# Altium schematic sheet Sheet1.SchDoc
size 431 x 279 mm; SheetNumber: 1; SheetTotal: 1; ENG_APP_DATE: --/--/--; DSN_APP_DATE: --/--/--; CHK_APP_DATE: --/--/--
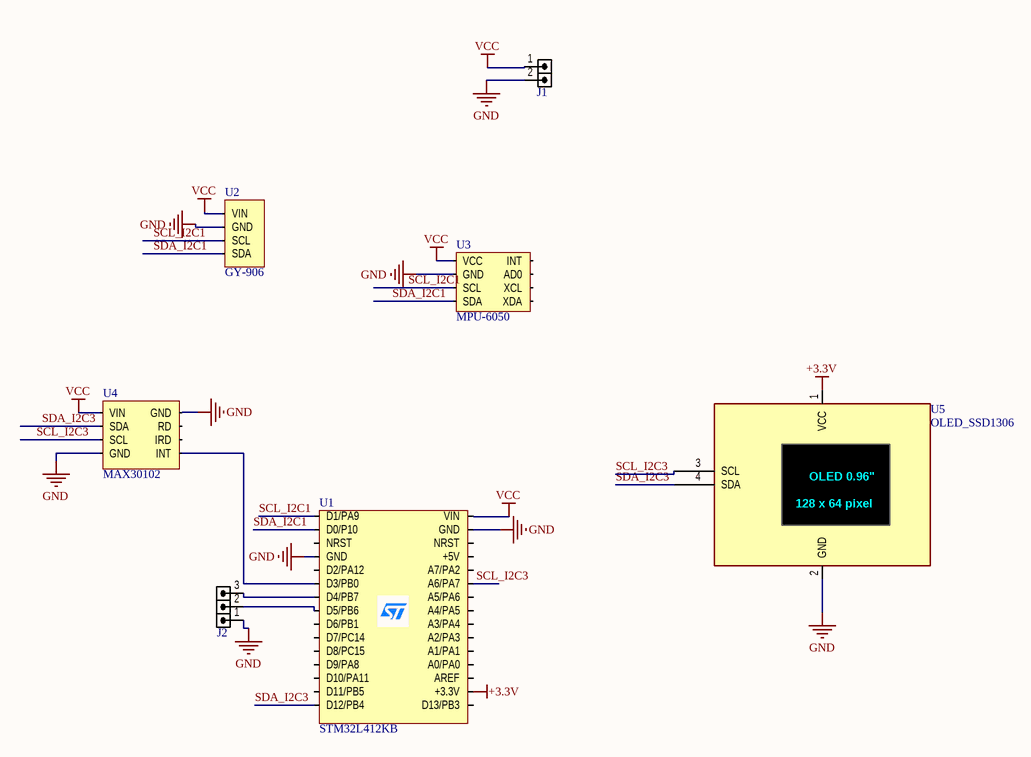
[diagram p0: Sheet1.SchDoc]

## Parts
J1  HDRM2  [HDR_M_1X2]  (value not drawn)
J2  HDRM3  [HDR_M_1X3]  (value not drawn)
U1  STM32L412KB  [NUCLEO32]
U2  GY-906  [GY-906]
U3  MPU-6050  [MPU-6050]
U4  MAX30102  [max30102]
U5  OLED_SSD1306  [OLED_SSD1306_64_I2C]

## Nets
+3.3V: U1.17(+3.3V) U5.1(VCC)
GND: J1.2 J2.1 U1.4(GND) U1.29(GND) U2.2(GND) U3.2(GND) U4.4(GND) U4.8(GND) U5.2(GND)
VCC: J1.1 U1.30(VIN) U2.1(VIN) U3.1(VCC) U4.1(VIN)
SCL_I2C1: U1.1(D1/PA9) U2.3(SCL) U3.3(SCL)
SCL_I2C3: U1.25(A6/PA7) U4.3(SCL) U5.3(SCL)
SDA_I2C1: U1.2(D0/P10) U2.4(SDA) U3.4(SDA)
SDA_I2C3: U1.15(D12/PB4) U4.2(SDA) U5.4(SDA)
NetJ2_2: J2.2 U1.8(D5/PB6)
NetJ2_3: J2.3 U1.7(D4/PB7)
NetU1_6: U1.6(D3/PB0) U4.5(INT)

Not connected (* = marked no-connect by the designer): U1 3(NRST) 5(D2/PA12) 9(D6/PB1) 10(D7/PC14) 11(D8/PC15) 12(D9/PA8) 13(D10/PA11) 14(D11/PB5) 16(D13/PB3) 18(AREF) 19(A0/PA0) 20(A1/PA1) 21(A2/PA3) 22(A3/PA4) 23(A4/PA5) 24(A5/PA6) 26(A7/PA2) 27(+5V) 28(NRST); U3 5(XDA) 6(XCL) 7(AD0) 8(INT); U4 6(IRD) 7(RD)

## Notes on the sheet
- 8
- 7
- 6
- 5
- 4
- 3
- DWG. NO.
- REV.
- SHT.
- 2
- 1
- THIS DOCUMENT AND THE DATA DISCLOSED HEREIN OR HEREWITH IS THE PROPERTY OF ALTIUM LIMITED AND MAY BE FREELY DISTRIBUTED IN WHOLE. NO RIGHTS ARE RESERVED OR EXPRESS OR IMPLIED WARANTEE GIVEN.
- REVISION
- DESCRIPTION
- DATE
- APPROVED
- F
- E
- D
- C
- B
- ENG:
- APPROVALS
- PROJECT
- SUITE 200
- 2175 SALK AVENUE
- CARLSBAD, CA 92008
- A
- DSN:
- CHK:
- REFERENCE DOCUMENTS
- PROJECT REVISION:
- TITLE
- DOCUMENT REVISION:
- DESIGN ITEM:
- USA
- BOM:
- FAB DWG:
- PCB DWG:
- ASSY DWG:
- SCALE:
- SIZE
- CAGE CODE
- FILE NAME
- DWG NO.
- SHEET
- OF
- REV
- (in symbol OLED_SSD1306_64_I2C) OLED 0.96"; 128 x 64 pixel

## Library data of the parts
J1 = Header Male THT 1x2: CONN, HEADER, Male, pitch: 2.54mm, 2POS; VALUE: HDRM2
J2 = Header Male THT 1x3: CONN, HEADER, Male, pitch: 2.54mm, 3POS; VALUE: HDRM3
U5 = OLED_SSD1306_64_I2C: MONOCHROME 1.3 128X64; Manufacturer: Adafruit Industries; Manufacturer Part Number: 326; Resolution (height): 64pixel; Resolution (width): 128pixel; Interface: I2C,SPI; Background Color: Black; Diagonal Size: 0.96inch; Supplier 1: Mouser; RoHS: Yes; Category: LCD, OLED, Graphic Displays; Stock 1: 164; Pricing 1: 1=19.50000, 10=19.50000 (USD); Case/Package: Module; ComponentLink1URL: https://datasheet.ciiva.com/6967/1718446-6967825.pdf?src-supplier=Newark; ComponentLink1Description: https://datasheet.ciiva.com/6967/1718446-6967825.pdf?src-supplier=Newark; ComponentLink2URL: https://datasheet.ciiva.com/39121/2211952-39121704.pdf?src-supplier=Jameco; ComponentLink2Description: https://datasheet.ciiva.com/39121/2211952-39121704.pdf?src-supplier=Jameco; Supplier Part Number 1: 485-326; Supplier 2: Mouser; Stock 2: 2128; Pricing 2: 1=19.95000, 10=19.95000 (USD); ComponentLink3URL: https://learn.adafruit.com/downloads/pdf/monochrome-oled-breakouts.pdf?src-supplier=Digi-Key; ComponentLink3Description: https://learn.adafruit.com/downloads/pdf/monochrome-oled-breakouts.pdf?src-supplier=Digi-Key; Supplier Part Number 2: 485-938; VALUE: OLED_SSD1306